# Altium schematic sheet baseControl2.SchDoc
size A4
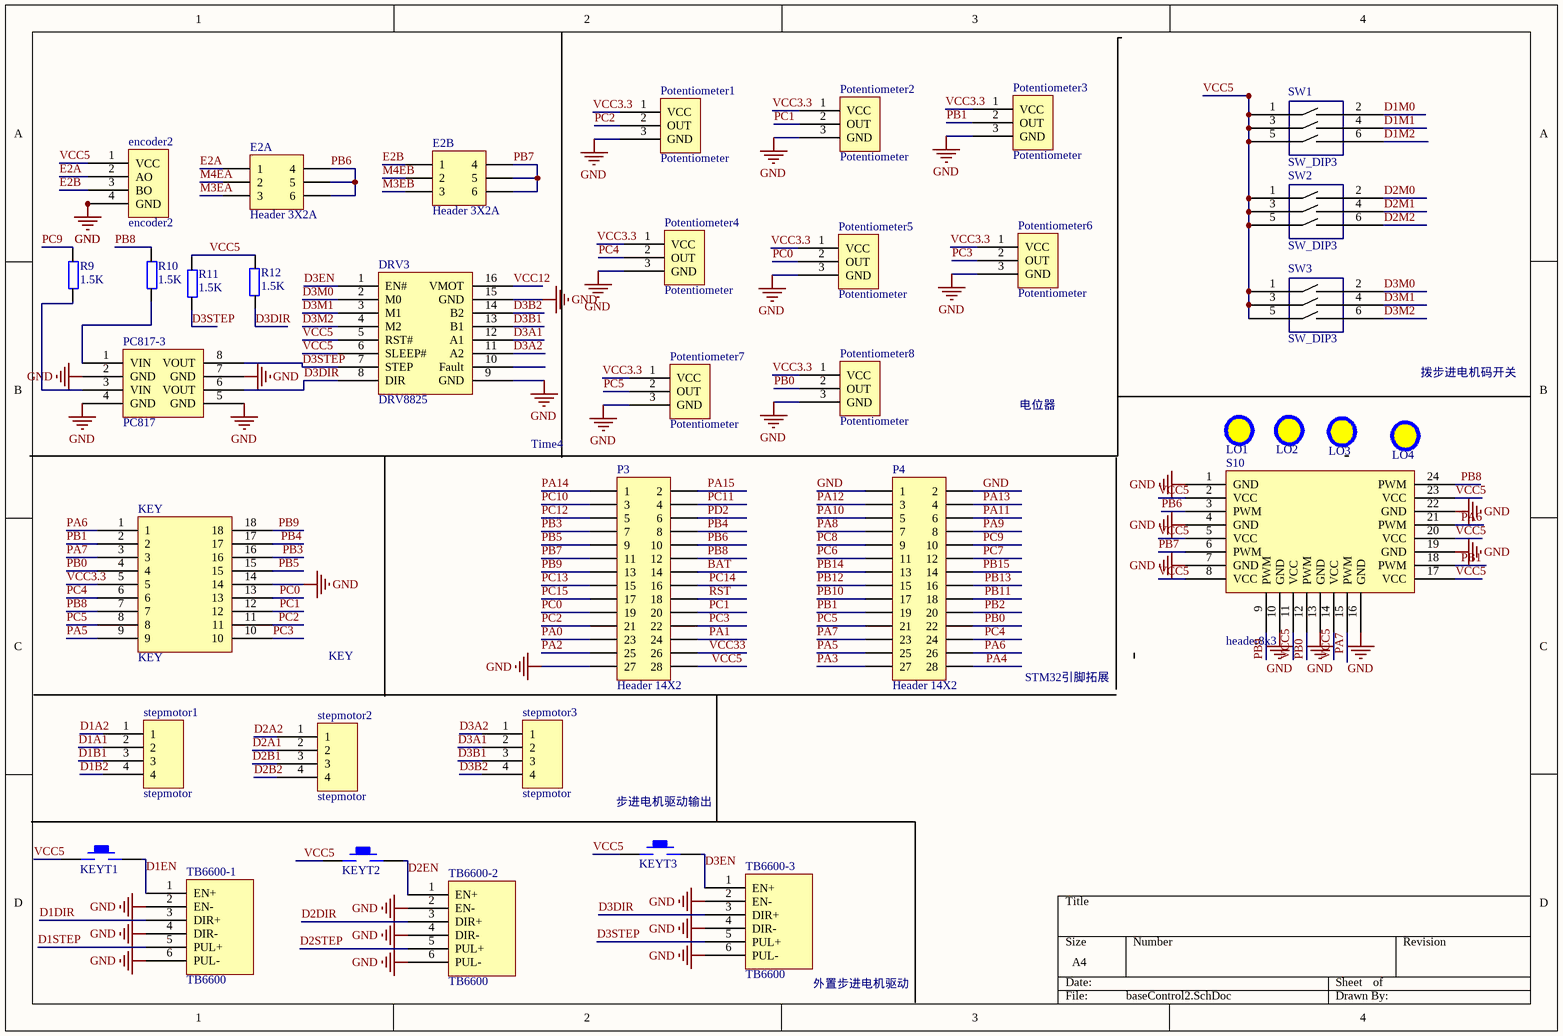
[diagram p0: baseControl2.SchDoc]

## Parts
DRV3  DRV8825  [DRV8825]
E2A  Header 3X2A  [HDR2X3_CEN]
E2B  Header 3X2A  [HDR2X3_CEN]
encoder2  encoder2  [XH-4-254]
KEY  KEY  [KEY]
KEYT1  KEY  [KEY_M]  (value not drawn)
KEYT2  KEY  [KEY_M]  (value not drawn)
KEYT3  KEY  [KEY_M]  (value not drawn)
LO1  螺丝孔  [VIA]  (value not drawn)
LO2  螺丝孔  [VIA]  (value not drawn)
LO3  螺丝孔  [VIA]  (value not drawn)
LO4  螺丝孔  [VIA]  (value not drawn)
P3  Header 14X2  [HDR2X14]
P4  Header 14X2  [HDR2X14]
PC817-3  PC817  [DIP4]
Potentiometer1  Potentiometer  [Potentiometer]
Potentiometer2  Potentiometer  [Potentiometer]
Potentiometer3  Potentiometer  [Potentiometer]
Potentiometer4  Potentiometer  [Potentiometer]
Potentiometer5  Potentiometer  [Potentiometer]
Potentiometer6  Potentiometer  [Potentiometer]
Potentiometer7  Potentiometer  [Potentiometer]
Potentiometer8  Potentiometer  [Potentiometer]
R9  1.5K  [0603P]
R10  1.5K  [0603P]
R11  1.5K  [0603P]
R12  1.5K  [0603P]
S10  header8x3  [header8X3]
stepmotor1  stepmotor  [XH-4-254]
stepmotor2  stepmotor  [XH-4-254]
stepmotor3  stepmotor  [XH-4-254]
SW1  SW_DIP3  [SW_DIP3]
SW2  SW_DIP3  [SW_DIP3]
SW3  SW_DIP3  [SW_DIP3]
TB6600-1  TB6600  [XH-6-254]
TB6600-2  TB6600  [XH-6-254]
TB6600-3  TB6600  [XH-6-254]

## Nets
GND: DRV3.9(GND) DRV3.15(GND) encoder2.4(GND) KEY.14 P3.27 P4.1 P4.2 PC817-3.2(GND) PC817-3.4(GND) PC817-3.5(GND) PC817-3.7(GND) Potentiometer1.3(GND) Potentiometer2.3(GND) Potentiometer3.3(GND) Potentiometer4.3(GND) Potentiometer5.3(GND) Potentiometer6.3(GND) Potentiometer7.3(GND) Potentiometer8.3(GND) S10.1(GND) S10.4(GND) S10.7(GND) S10.10(GND) S10.13(GND) S10.16(GND) S10.19(GND) S10.22(GND) TB6600-1.2(EN-) TB6600-1.4(DIR-) TB6600-1.6(PUL-) TB6600-2.2(EN-) TB6600-2.4(DIR-) TB6600-2.6(PUL-) TB6600-3.2(EN-) TB6600-3.4(DIR-) TB6600-3.6(PUL-)
BAT: P3.14
D1A1: stepmotor1.2
D1A2: stepmotor1.1
D1B1: stepmotor1.3
D1B2: stepmotor1.4
D1DIR: TB6600-1.3(DIR+)
D1EN: KEYT1.2 TB6600-1.1(EN+)
D1M0: SW1.2
D1M1: SW1.4
D1M2: SW1.6
D1STEP: TB6600-1.5(PUL+)
D2A1: stepmotor2.2
D2A2: stepmotor2.1
D2B1: stepmotor2.3
D2B2: stepmotor2.4
D2DIR: TB6600-2.3(DIR+)
D2EN: KEYT2.2 TB6600-2.1(EN+)
D2M0: SW2.2
D2M1: SW2.4
D2M2: SW2.6
D2STEP: TB6600-2.5(PUL+)
D3A1: DRV3.12(A1) stepmotor3.2
D3A2: DRV3.11(A2) stepmotor3.1
D3B1: DRV3.13(B1) stepmotor3.3
D3B2: DRV3.14(B2) stepmotor3.4
D3DIR: DRV3.8(DIR) PC817-3.6(VOUT) R12.2 TB6600-3.3(DIR+)
D3EN: DRV3.1(EN#) KEYT3.2 TB6600-3.1(EN+)
D3M0: DRV3.2(M0) SW3.2
D3M1: DRV3.3(M1) SW3.4
D3M2: DRV3.4(M2) SW3.6
D3STEP: DRV3.7(STEP) PC817-3.8(VOUT) R11.1 TB6600-3.5(PUL+)
E2A: E2A.1 encoder2.2(AO)
E2B: E2B.1 encoder2.3(BO)
M3EA: E2A.3
M3EB: E2B.3
M4EA: E2A.2
M4EB: E2B.2
PA0: P3.23
PA1: P3.24
PA2: P3.25
PA3: P4.27
PA4: P4.28
PA5: KEY.9 P4.25
PA6: KEY.1 P4.26 S10.21(PWM)
PA7: KEY.3 P4.23 S10.15(PWM)
PA8: P4.7
PA9: P4.8
PA10: P4.5
PA11: P4.6
PA12: P4.3
PA13: P4.4
PA14: P3.1
PA15: P3.2
PB0: KEY.4 P4.22 Potentiometer8.2(OUT) S10.12(PWM)
PB1: KEY.2 P4.19 Potentiometer3.2(OUT) S10.18(PWM)
PB2: P4.20
PB3: KEY.16 P3.7
PB4: KEY.17 P3.8
PB5: KEY.15 P3.9
PB6: E2A.4 E2A.5 E2A.6 P3.10 S10.3(PWM)
PB7: E2B.4 E2B.5 E2B.6 P3.11 S10.6(PWM)
PB8: KEY.7 P3.12 R10.2 S10.24(PWM)
PB9: KEY.18 P3.13 S10.9(PWM)
PB10: P4.17
PB11: P4.18
PB12: P4.15
PB13: P4.16
PB14: P4.13
PB15: P4.14
PC0: KEY.13 P3.19 Potentiometer5.2(OUT)
PC1: KEY.12 P3.20 Potentiometer2.2(OUT)
PC2: KEY.11 P3.21 Potentiometer1.2(OUT)
PC3: KEY.10 P3.22 Potentiometer6.2(OUT)
PC4: KEY.6 P4.24 Potentiometer4.2(OUT)
PC5: KEY.8 P4.21 Potentiometer7.2(OUT)
PC6: P4.11
PC7: P4.12
PC8: P4.9
PC9: P4.10 R9.2
PC10: P3.3
PC11: P3.4
PC12: P3.5
PC13: P3.15
PC14: P3.16
PC15: P3.17
PD2: P3.6
RST: P3.18
VCC3.3: KEY.5 Potentiometer1.1(VCC) Potentiometer2.1(VCC) Potentiometer3.1(VCC) Potentiometer4.1(VCC) Potentiometer5.1(VCC) Potentiometer6.1(VCC) Potentiometer7.1(VCC) Potentiometer8.1(VCC)
VCC5: DRV3.5(RST#) DRV3.6(SLEEP#) encoder2.1(VCC) KEYT1.1 KEYT2.1 KEYT3.1 P3.28 R11.2 R12.1 S10.2(VCC) S10.5(VCC) S10.8(VCC) S10.11(VCC) S10.14(VCC) S10.17(VCC) S10.20(VCC) S10.23(VCC) SW1.1 SW1.3 SW1.5 SW2.1 SW2.3 SW2.5 SW3.1 SW3.3 SW3.5
VCC12: DRV3.16(VMOT)
VCC33: P3.26
NetPC817-3_1: PC817-3.1(VIN) R10.1
NetPC817-3_3: PC817-3.3(VIN) R9.1

Not connected (* = marked no-connect by the designer): DRV3 10(Fault)

## Notes on the sheet
- 拨步进电机码开关
- Time4
- 电位器
- KEY
- STM32引脚拓展
- (near KEYT3) 步进电机驱动输出
- 外置步进电机驱动

## Library data of the parts
E2A E2B = Header 3X2A: Header, 3-Pin, Dual row; LatestRevisionDate: 17-Jul-2002; LatestRevisionNote: Re-released for DXP Platform.; Publisher: Altium Limited
encoder2 = encoder
P3 P4 = Header 14X2: Header, 14-Pin, Dual row; LatestRevisionDate: 17-Jul-2002; LatestRevisionNote: Re-released for DXP Platform.; Publisher: Altium Limited
R9-R12 = R